# Altium schematic sheet emag.SchDoc
size Letter; SheetNumber: 4; SheetTotal: 8
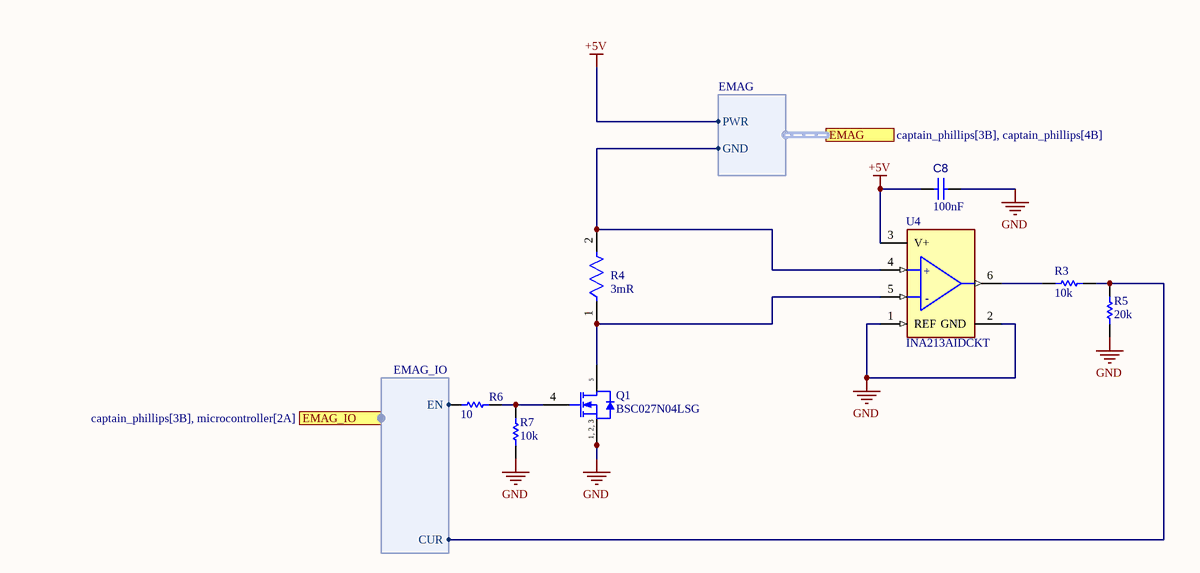
[diagram p0: emag.SchDoc]

## Parts
C8  value 100nF  [3]  (hidden comment: Capacitor 100 nF 10 % 50V 0603)
Q1  BSC027N04LSG  [INF-PG-TDSON-8-1_V]
R3  value 10k  [RESC1608X55X25ML10T15]  (hidden comment: 10K 1 0603)
R4  Resistance: 3mR  [FP-CRE2512-R001-R004-MFG]  (hidden comment: CRE2512-FZ-R003E-3)
R5  value 20k  [RESC1608X55X25ML10T15]  (hidden comment: 20K 1% 0603)
R6  value 10  [RESC1608X55X25ML10T15]  (hidden comment: 10R 1 0603)
R7  value 10k  [RESC1608X55X25ML10T15]  (hidden comment: 10K 1 0603)
U4  INA213AIDCKT  [FP-DCK0006A-MFG]

## Ports
EMAG (harness EMAG, see captain_phillips[3B], captain_phillips[4B]), EMAG_IO (harness EMAG_IO, see captain_phillips[3B], microcontroller[2A])

## Harnesses
EMAG: PWR, GND
EMAG_IO: EN, CUR

## Nets
+5V: C8.1 U4.3(V+) ; port EMAG.PWR
GND: C8.2 Q1.1(SOURCE) Q1.2(SOURCE) Q1.3(SOURCE) R5.1 R7.1 U4.1(REF) U4.2(GND)
NetQ1_4: Q1.4(GATE) R6.2 R7.2
NetQ1_5: Q1.5(DRAIN) R4.1 U4.5(IN-)
NetR3_1: R3.1 R5.2 ; port EMAG_IO.CUR
NetR3_2: R3.2 U4.6(OUT)
NetR4_2: R4.2 U4.4(IN+) ; port EMAG.GND
NetR6_1: R6.1 ; port EMAG_IO.EN

## Notes on the sheet
- (in symbol CMP-013-00042-10) 1, 2, 3
- (in symbol CMP-014-00031-1) +; -

## Library data of the parts
C8 = CMP-001-00092-5: CAP CER 100 nF 50V X7R 0603; Capacitor Type: Ceramic; Tolerance: 10%; Voltage Rating: 50V; Case/Package: 0603; LCSC Part Number: C14663
Q1 = CMP-013-00042-10: Power Field-Effect Transistor, 24A I(D), 40V, 0.0041ohm, 1-Element, N-Channel, Silicon, Metal-oxide Semiconductor-FET; Operating Mode: ENHANCEMENT MODE; Drain-source On Resistance-Max: 4.1mR; Case Connection: DRAIN; Pulsed Drain Current-Max (IDM): 400A; Power Dissipation-Max (Abs): 83W; Drain Current-Max (Abs) (ID): 100A; DS Breakdown Voltage-Min: 40V; Pins: 5; LCSC Part Number: C2802513; Drain Current-Max (ID): 24A; RoHS Compliant: Yes; Max Operating Temperature: 150°C; FET Technology: METAL-OXIDE SEMICONDUCTOR; Polarity/Channel Type: N-CHANNEL
R3 R7 = CMP-0103-0607-9: 0603 (1608 Metric) 1/10 W 10K 1 Thick Film Chip Resistor; Power: 100mW; Tolerance: 1%; Case-EIA: 0603; Case-Metric: 1608; Temp. Coefficent: ±100; LCSC Part Number: C25804; Technology: SMT; Case/Package: 0603
R4 = CMP-07231-007668-1: RES 0.003 OHM 1% 3W 2512; Temperature Coefficient: 75ppm/°C; Mount: Surface Mount; Max Operating Temperature: 170°C; Min Operating Temperature: -55°C; Technology: METAL STRIP; Series: CRE2512; Case Code (Metric): 6432; Depth: 3.35mm; Case Code (Imperial): 2512; Width: 0.132inch; Case/Package: 2512; Packaging: Cut Tape; REACH SVHC: No SVHC; Resistance Tolerance: 1%; Termination: Solder; Tolerance: 1%; Features: Moisture Resistant; RoHS Compliant: No; Height: 0.035inch; Resistor Type: Metal Alloy; Power Rating: 3W; Number of Terminations: 2; Length: 0.254inch; Contact Plating: Tin; Max Power Dissipation: 3W
R5 = CMP-0103-0614-9: 0603 (1608 Metric) 1/10 W 20K 1 Thick Film Chip Resistor; Case-EIA: 0603; Case-Metric: 1608; Temp. Coefficent: ±100; Power: 100mW; Technology: SMT; Case/Package: 0603; Tolerance: 1%; LCSC Part Number: C4184
R6 = CMP-0103-0535-7: 0603 (1608 Metric) 1/10 W 10R 1 Thick Film Chip Resistor; Temp. Coefficent: ±100; Power: 100mW; Case-EIA: 0603; Tolerance: 1%; Case-Metric: 1608; Technology: SMT
U4 = CMP-014-00031-1: Operational Amplifier, 1 Func, PDSO6; Nominal Supply Voltage: 5V; Min Supply Voltage: 2.7V; Channels: 1; Max Supply Voltage: 26V; Max Operating Temperature: 125°C; Case/Package: TSSOP; RoHS Compliant: Yes; Pins: 6; Min Operating Temperature: -40°C